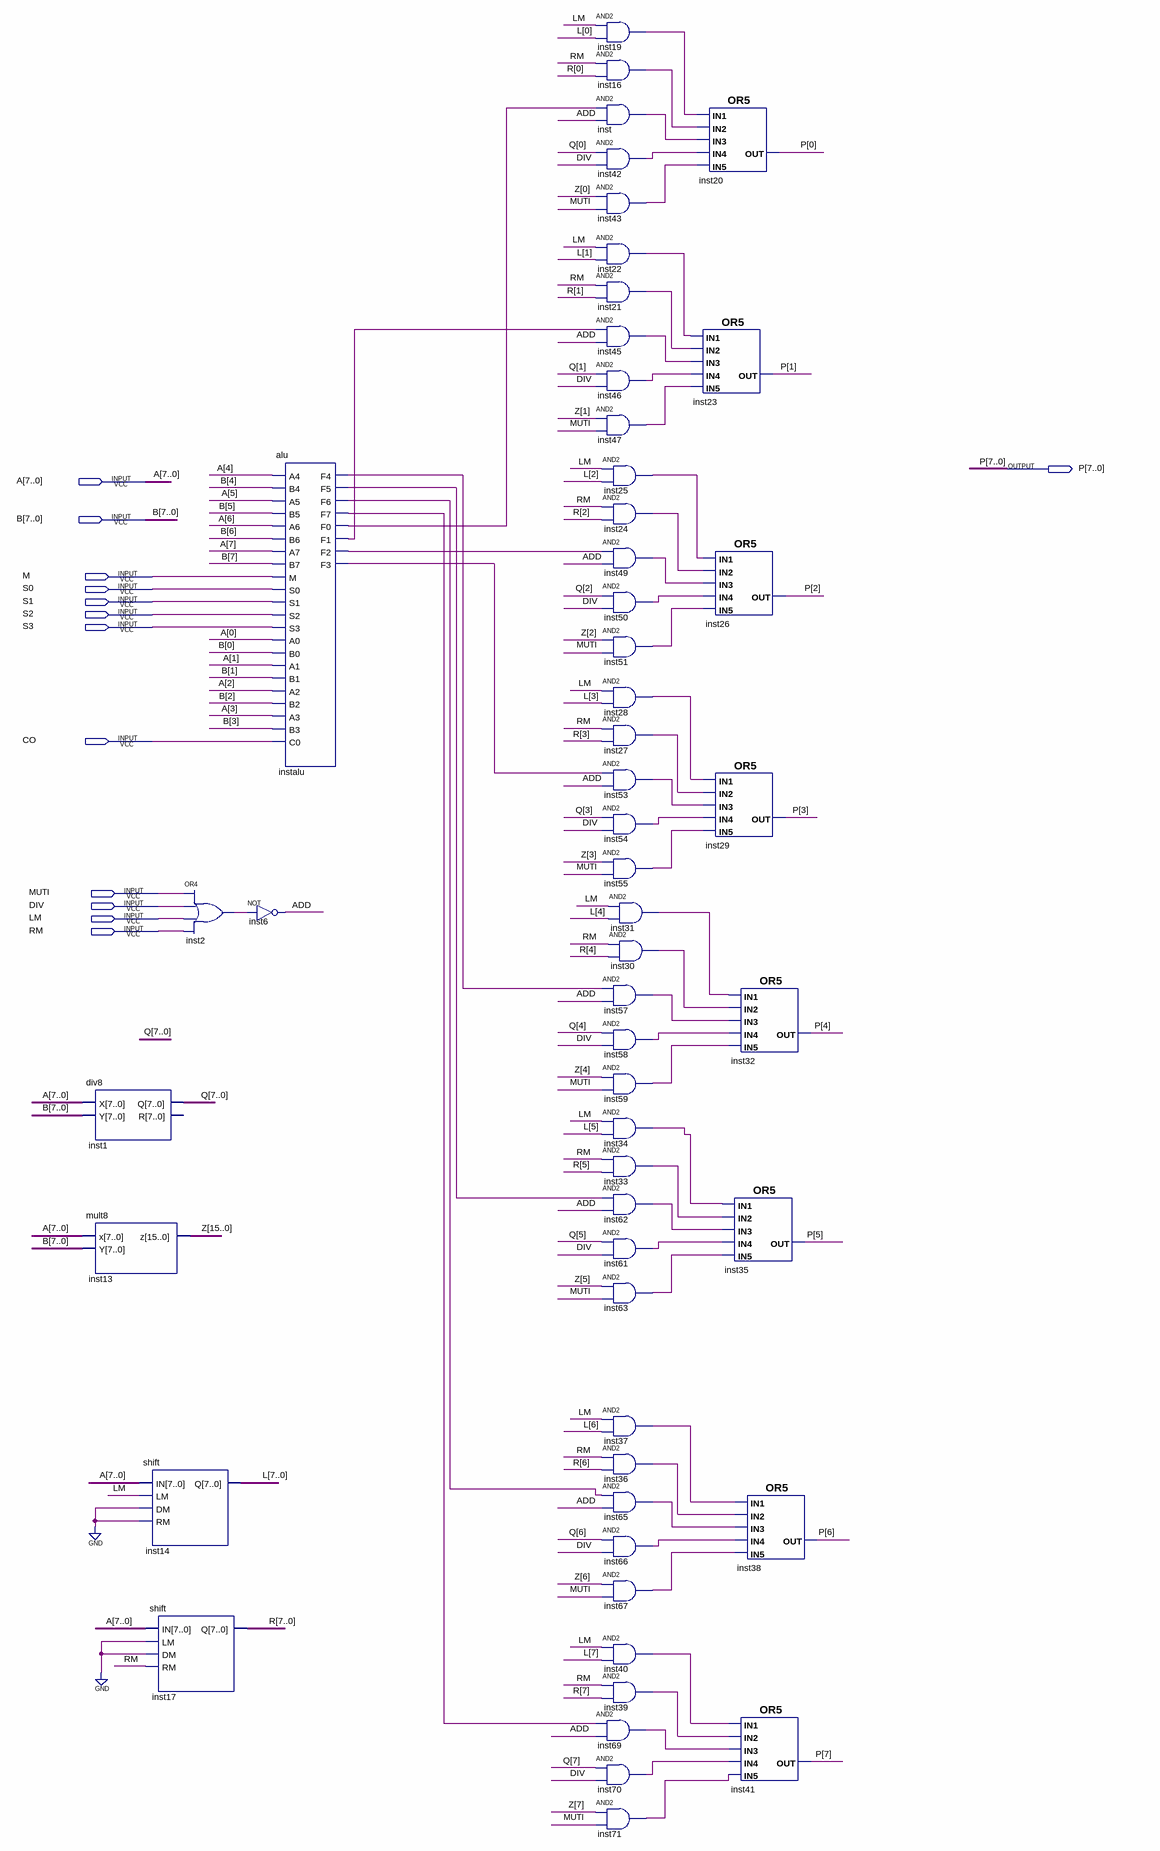
[diagram p0: schematic sheet]
// Quartus schematic ALUint.bdf as structural Verilog: 55 symbols, 13 pins
module ALUint (
  input  [7:0] A,
  input  [7:0] B,
  input  M,
  input  S0,
  input  S1,
  input  S2,
  input  S3,
  input  CO,
  input  MUTI,
  input  DIV,
  input  LM,
  input  RM,
  output [7:0] P
);

  wire ADD, inst2_out, inst16_out, inst19_out, inst21_out, inst22_out, inst24_out, inst25_out, inst27_out,
       inst28_out, inst30_out, inst31_out, inst33_out, inst34_out, inst36_out, inst37_out, inst39_out,
       inst40_out, inst42_out, inst43_out, inst45_out, inst46_out, inst47_out, inst49_out, inst50_out,
       inst51_out, inst53_out, inst54_out, inst55_out, inst57_out, inst58_out, inst59_out, inst61_out,
       inst62_out, inst63_out, inst65_out, inst66_out, inst67_out, inst69_out, inst70_out, inst71_out,
       inst_out, instalu_f0, instalu_f1, instalu_f2, instalu_f3, instalu_f4, instalu_f5, instalu_f6,
       instalu_f7;
  wire [7:0] L, Q, R;
  wire [15:0] Z;

  div8 inst1 (.X(A), .Y(B), .Q(Q));  // open: R
  mult8 inst13 (.x(A), .Y(B), .z(Z));
  shift inst14 (.IN(A), .LM(LM), .DM(1'b0), .RM(1'b0), .Q(L));
  shift inst17 (.IN(A), .LM(1'b0), .DM(1'b0), .RM(RM), .Q(R));
  or inst2 (inst2_out, MUTI, DIV, LM, RM);
  alu instalu (
    .A4(A[4]), .B4(B[4]), .A5(A[5]), .B5(B[5]), .A6(A[6]), .B6(B[6]), .A7(A[7]), .B7(B[7]), .M(M), .S0(S0),
    .S1(S1), .S2(S2), .S3(S3), .A0(A[0]), .B0(B[0]), .A1(A[1]), .B1(B[1]), .A2(A[2]), .B2(B[2]), .A3(A[3]),
    .B3(B[3]), .C0(CO), .F4(instalu_f4), .F5(instalu_f5), .F6(instalu_f6), .F7(instalu_f7), .F0(instalu_f0),
    .F1(instalu_f1), .F2(instalu_f2), .F3(instalu_f3));
  not inst6 (ADD, inst2_out);
  and inst19 (inst19_out, LM, L[0]);
  and inst16 (inst16_out, RM, R[0]);
  and inst (inst_out, instalu_f0, ADD);
  and inst42 (inst42_out, Q[0], DIV);
  and inst43 (inst43_out, Z[0], MUTI);
  and inst22 (inst22_out, LM, L[1]);
  and inst21 (inst21_out, RM, R[1]);
  and inst45 (inst45_out, instalu_f1, ADD);
  and inst46 (inst46_out, Q[1], DIV);
  and inst47 (inst47_out, Z[1], MUTI);
  and inst25 (inst25_out, LM, L[2]);
  and inst24 (inst24_out, RM, R[2]);
  and inst49 (inst49_out, instalu_f2, ADD);
  and inst50 (inst50_out, Q[2], DIV);
  and inst51 (inst51_out, Z[2], MUTI);
  and inst28 (inst28_out, LM, L[3]);
  and inst27 (inst27_out, RM, R[3]);
  and inst53 (inst53_out, instalu_f3, ADD);
  and inst54 (inst54_out, Q[3], DIV);
  and inst55 (inst55_out, Z[3], MUTI);
  and inst31 (inst31_out, LM, L[4]);
  and inst30 (inst30_out, RM, R[4]);
  and inst57 (inst57_out, instalu_f4, ADD);
  and inst58 (inst58_out, Q[4], DIV);
  and inst59 (inst59_out, Z[4], MUTI);
  and inst34 (inst34_out, LM, L[5]);
  and inst33 (inst33_out, RM, R[5]);
  and inst62 (inst62_out, instalu_f5, ADD);
  and inst61 (inst61_out, Q[5], DIV);
  and inst63 (inst63_out, Z[5], MUTI);
  and inst37 (inst37_out, LM, L[6]);
  and inst36 (inst36_out, RM, R[6]);
  and inst65 (inst65_out, instalu_f6, ADD);
  and inst66 (inst66_out, Q[6], DIV);
  and inst67 (inst67_out, Z[6], MUTI);
  and inst40 (inst40_out, LM, L[7]);
  and inst39 (inst39_out, RM, R[7]);
  and inst69 (inst69_out, instalu_f7, ADD);
  and inst70 (inst70_out, Q[7], DIV);
  and inst71 (inst71_out, Z[7], MUTI);
  or inst20 (P[0], inst19_out, inst16_out, inst_out, inst42_out, inst43_out);
  or inst23 (P[1], inst22_out, inst21_out, inst45_out, inst46_out, inst47_out);
  or inst26 (P[2], inst25_out, inst24_out, inst49_out, inst50_out, inst51_out);
  or inst29 (P[3], inst28_out, inst27_out, inst53_out, inst54_out, inst55_out);
  or inst32 (P[4], inst31_out, inst30_out, inst57_out, inst58_out, inst59_out);
  or inst35 (P[5], inst34_out, inst33_out, inst62_out, inst61_out, inst63_out);
  or inst38 (P[6], inst37_out, inst36_out, inst65_out, inst66_out, inst67_out);
  or inst41 (P[7], inst40_out, inst39_out, inst69_out, inst70_out, inst71_out);
endmodule
